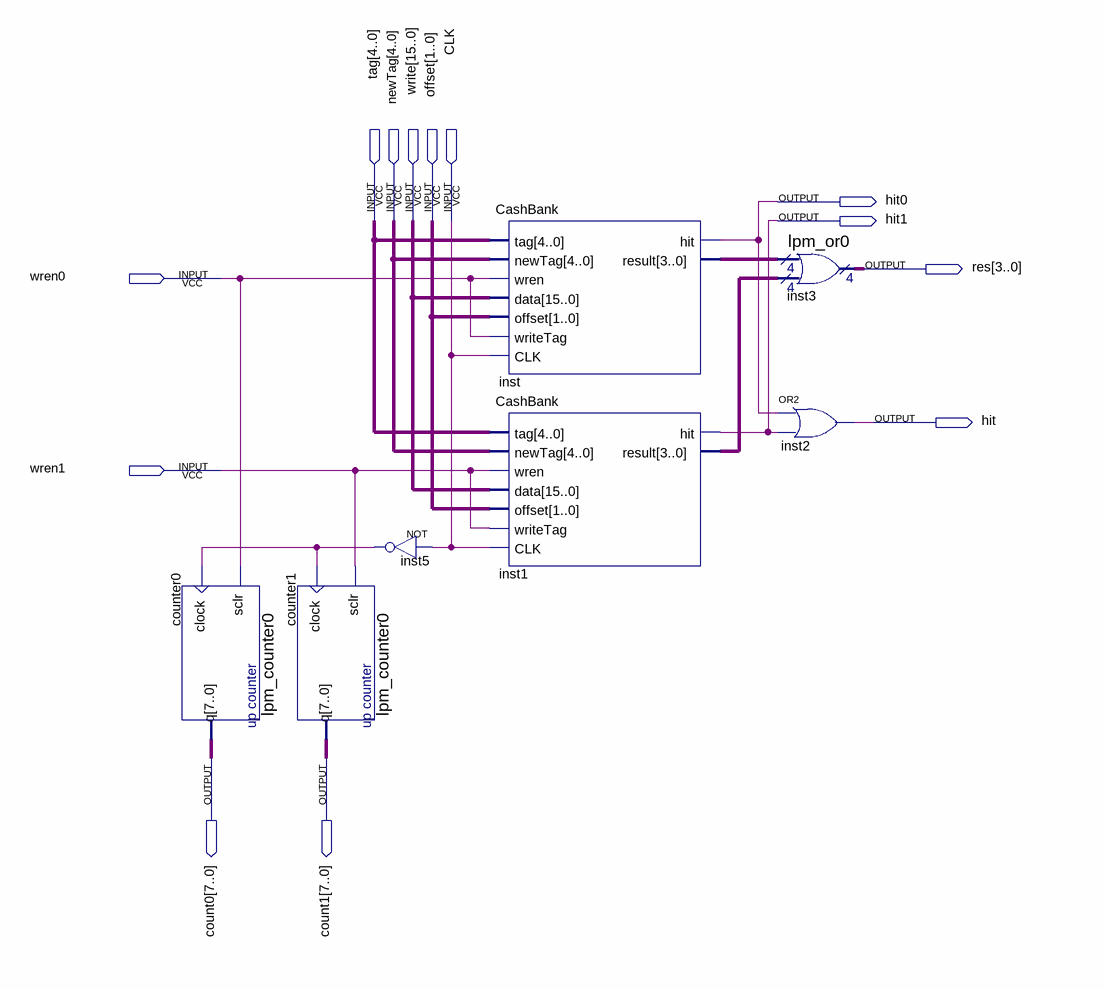
[diagram p0: schematic sheet]
// Quartus schematic cashSystem.bdf as structural Verilog: 7 symbols, 13 pins
module cashSystem (
  input  [4:0] tag,
  input  [4:0] newTag,
  input  [15:0] write,
  input  [1:0] offset,
  input  CLK,
  input  wren0,
  input  wren1,
  output hit0,
  output hit1,
  output [3:0] res,
  output hit,
  output [7:0] count0,
  output [7:0] count1
);

  wire inst5_out;
  wire [3:0] inst1_result, inst_result;

  lpm_counter0 counter0 (.sclr(wren0), .clock(inst5_out), .q(count0));
  lpm_counter0 counter1 (.sclr(wren1), .clock(inst5_out), .q(count1));
  not inst5 (inst5_out, CLK);
  CashBank inst (
    .tag(tag), .newTag(newTag), .wren(wren0), .data(write), .offset(offset), .writeTag(wren0), .CLK(CLK),
    .hit(hit0), .result(inst_result));
  CashBank inst1 (
    .tag(tag), .newTag(newTag), .wren(wren1), .data(write), .offset(offset), .writeTag(wren1), .CLK(CLK),
    .hit(hit1), .result(inst1_result));
  lpm_or0 inst3 (.data0x(inst_result), .data1x(inst1_result), .result(res));
  or inst2 (hit, hit0, hit1);
endmodule
